# EAGLE board tester-rp (EAGLE 6.6.0), part 1 of 2
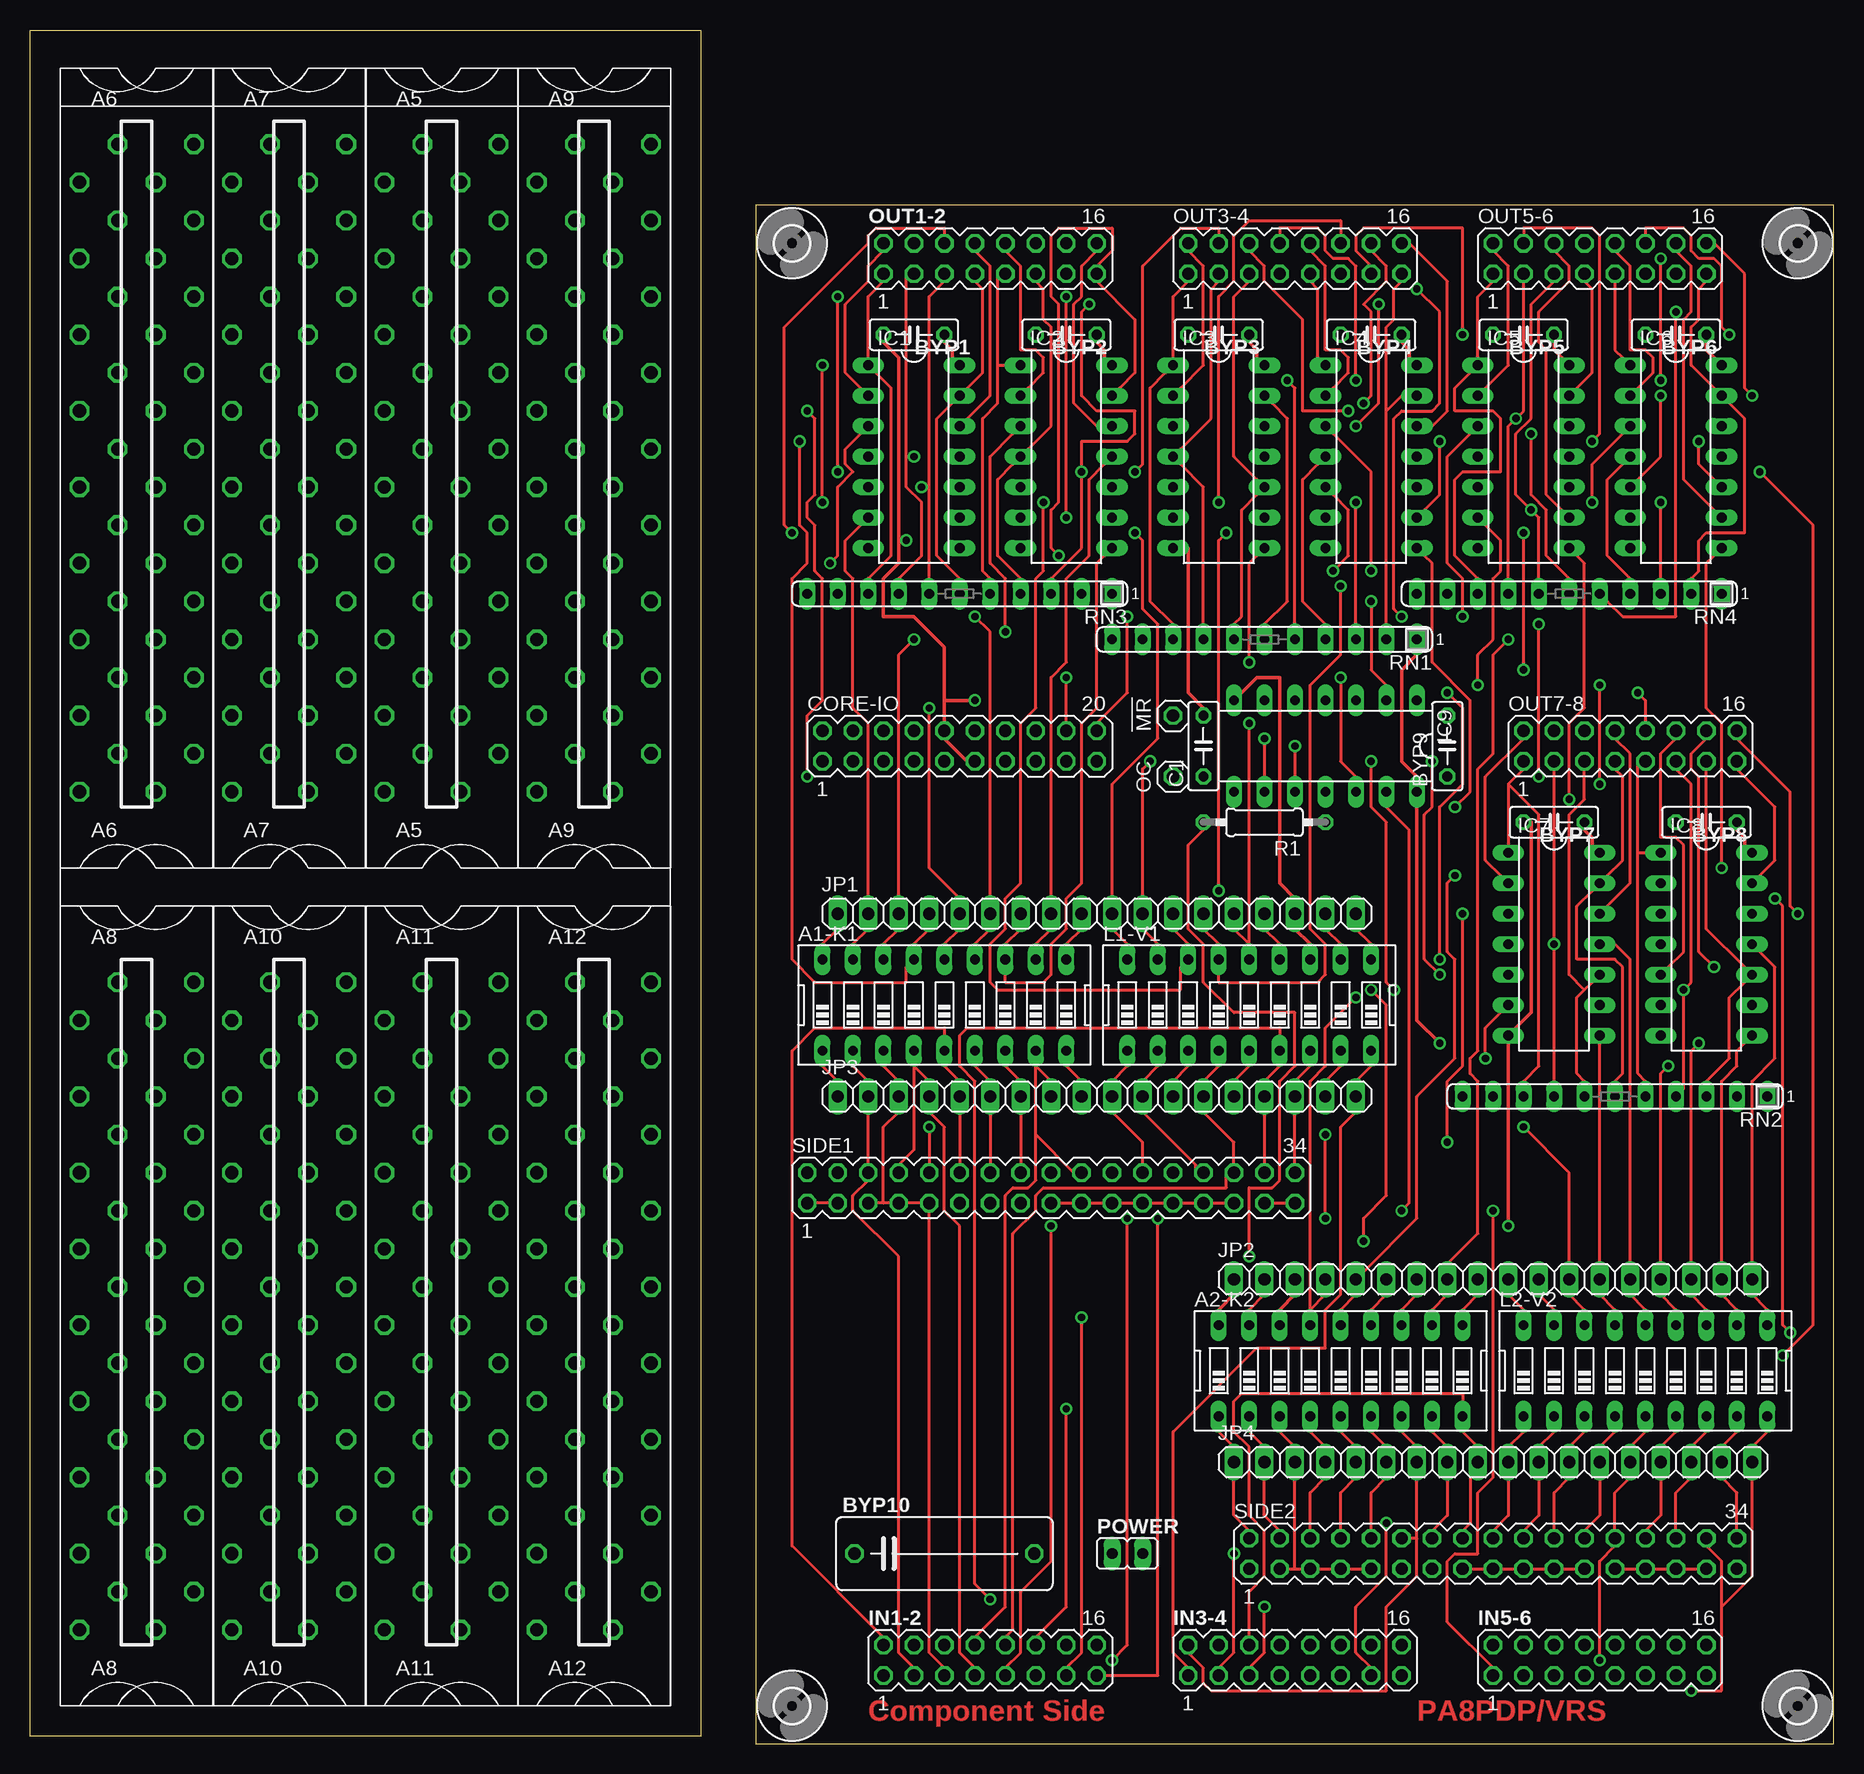
[diagram p3: board, top side]
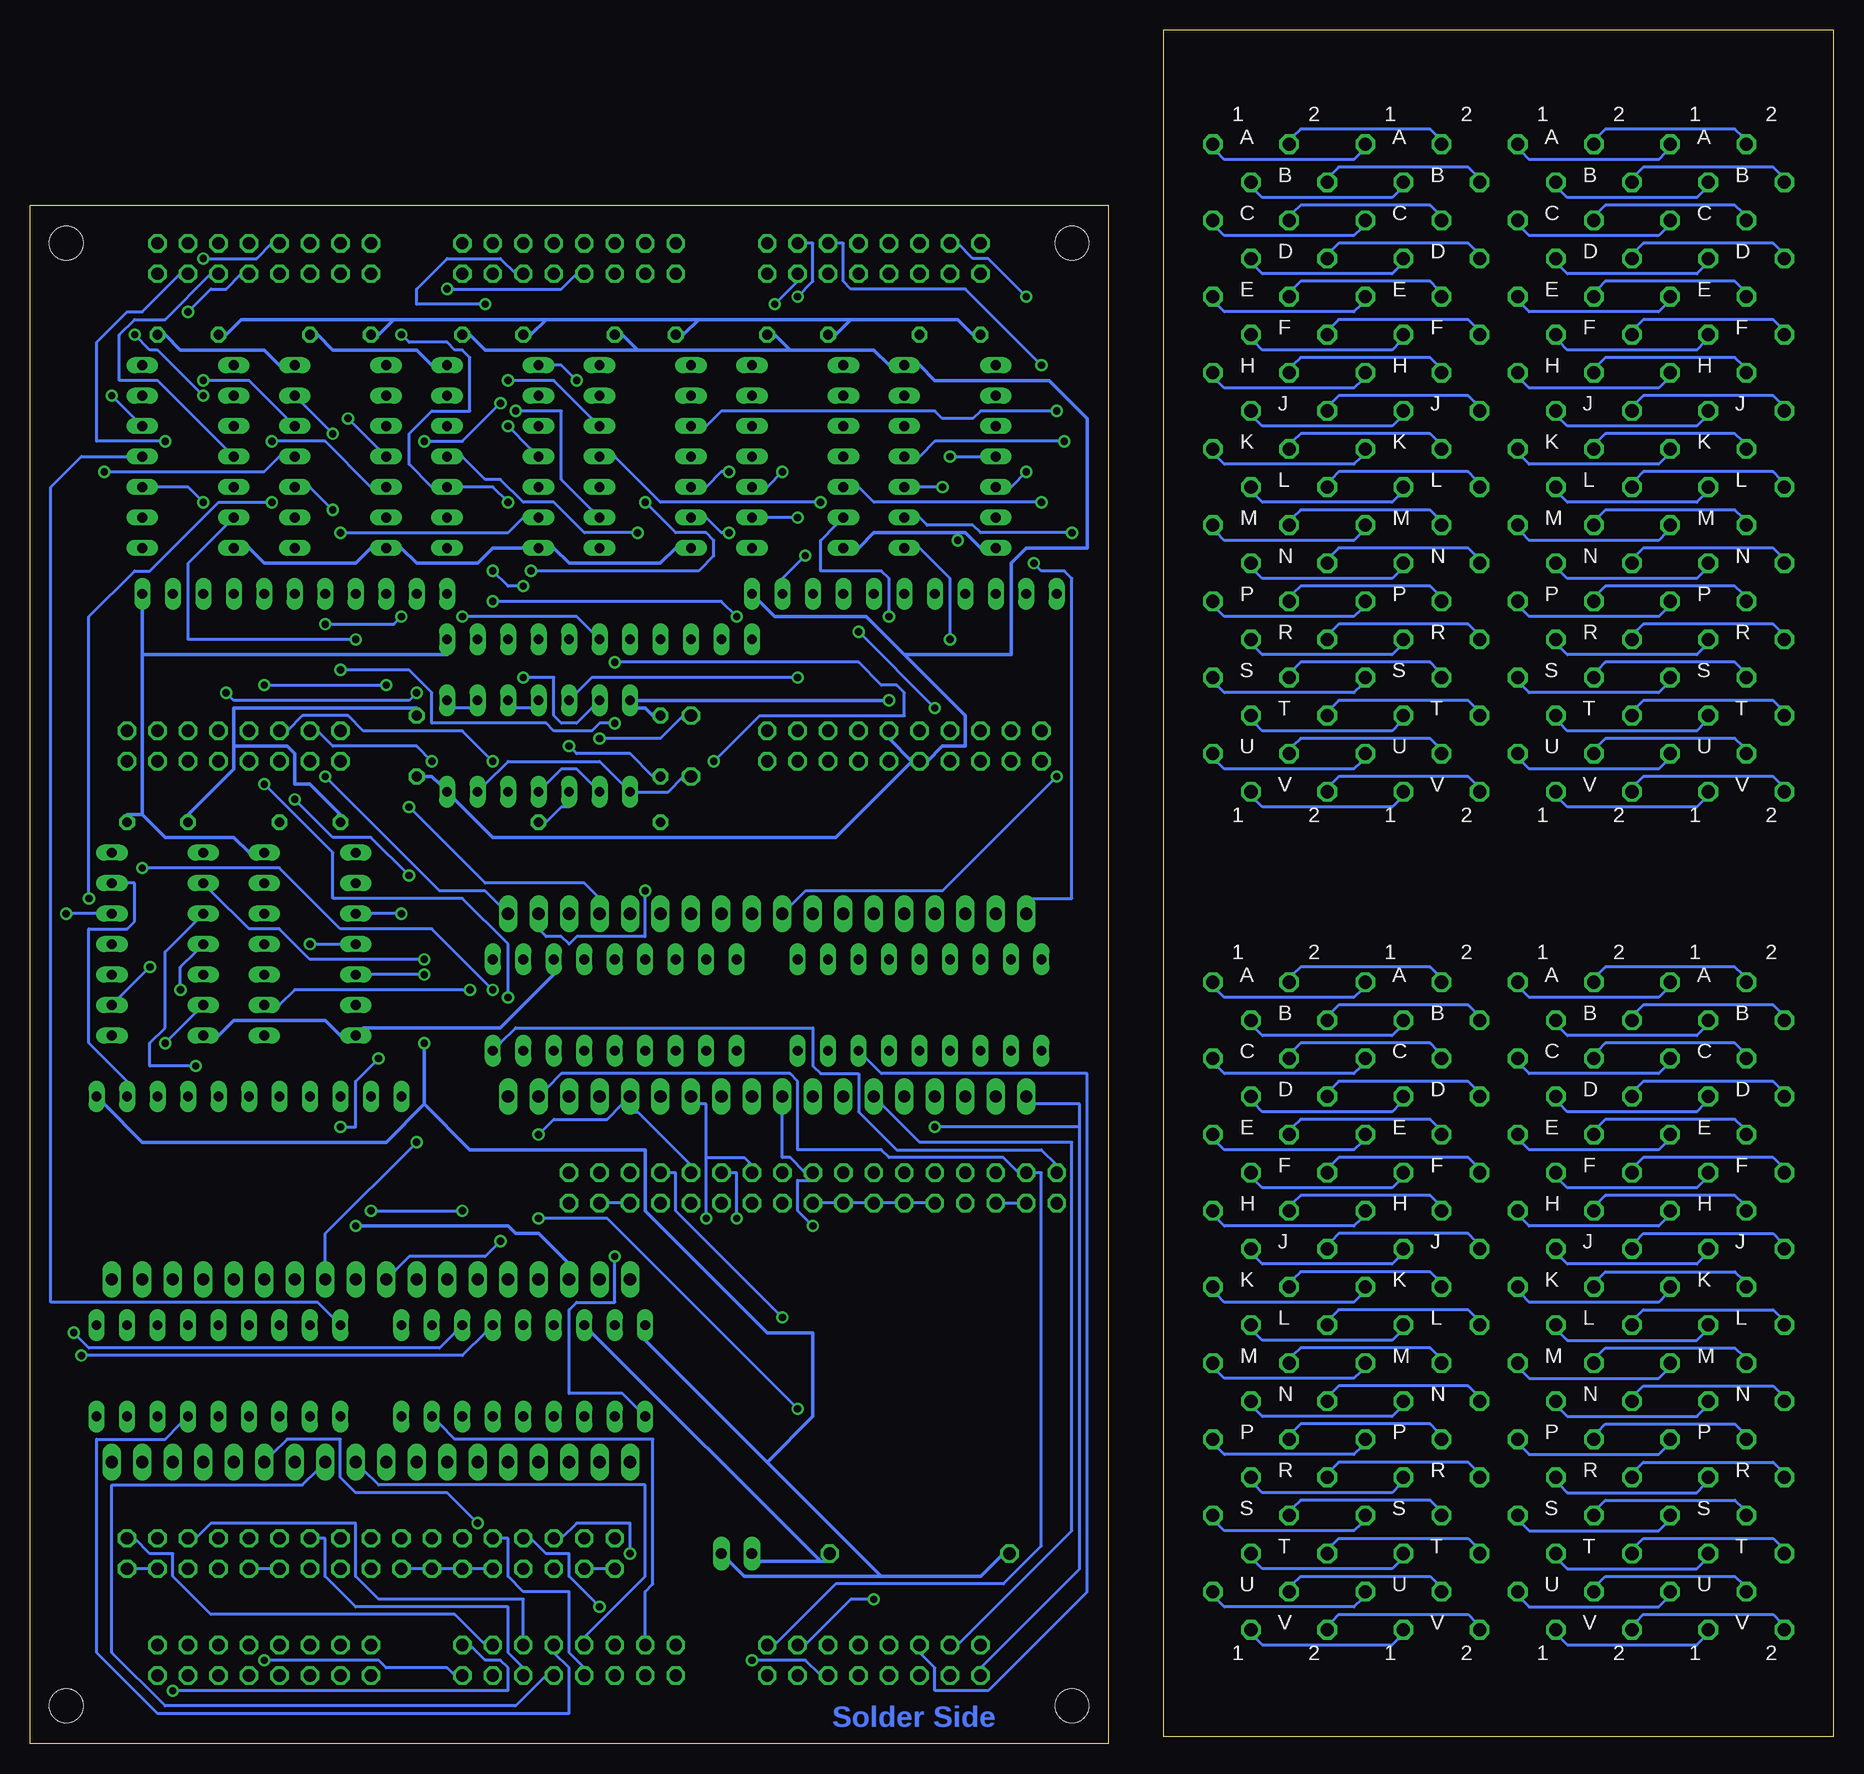
[diagram p4: board, bottom side, seen from below]

Size 150.33 x 142.86 mm. Coordinates in mm from the lower left corner, seen from the top.
Outline: 60.49,128.25 60.49,0 150.33,0 150.33,128.25 60.49,128.25
Outline: 55.88,0.62 0,0.62 0,142.86 55.88,142.86 55.88,0.62
Copper layers (1*16): Top 0.035mm / dielectric 1.5mm / Bottom 0.035mm
Design rules "olimex10mil": minimum track width 10mil, minimum drill 24mil, track to track 10mil, track to pad 10mil, pad to pad 10mil, via to via 10mil, smd to smd 10mil, copper to edge 40mil, drill to drill 10mil, minimum pad ring 10mil, minimum via ring 8mil, stop-mask expansion 0mil, vias tented up to drill 0mil, thermal gap 10mil
Net classes: 1 Power: width 0.305 mm, clearance 0.305 mm

## Footprints (pad centres in the part's own frame; a part is rotated, then mirrored left to right if it is on the bottom)
1X01 = drill 1.016 octagon: 1 0,0
EDG-09 = drill 0.813 long: 1 -10.16,-3.81; 2 -7.62,-3.81; 3 -5.08,-3.81; 4 -2.54,-3.81; 5 0,-3.81; 6 2.54,-3.81; 7 5.08,-3.81; 8 7.62,-3.81; 9 10.16,-3.81; 10 10.16,3.81; 11 7.62,3.81; 12 5.08,3.81; 13 2.54,3.81; 14 0,3.81; 15 -2.54,3.81; 16 -5.08,3.81; 17 -7.62,3.81; 18 -10.16,3.81
H807 = drill 1.092 octagon: A1 4.763,28.575; A2 -1.587,28.575; B1 1.587,25.4; B2 -4.763,25.4; C1 4.763,22.225; C2 -1.587,22.225; D1 1.587,19.05; D2 -4.763,19.05; E1 4.763,15.875; E2 -1.587,15.875; F1 1.587,12.7; F2 -4.763,12.7; H1 4.763,9.525; H2 -1.587,9.525; J1 1.587,6.35; J2 -4.763,6.35; K1 4.763,3.175; K2 -1.587,3.175; L1 1.587,0; L2 -4.763,0; M1 4.763,-3.175; M2 -1.587,-3.175; N1 1.587,-6.35; N2 -4.763,-6.35; P1 4.763,-9.525; P2 -1.587,-9.525; R1 1.587,-12.7; R2 -4.763,-12.7; S1 4.763,-15.875; S2 -1.587,-15.875; T1 1.587,-19.05; T2 -4.763,-19.05; U1 4.763,-22.225; U2 -1.587,-22.225; V1 1.587,-25.4; V2 -4.763,-25.4
C050-025X075 = drill 0.813 octagon: 1 -2.54,0; 2 2.54,0
C150-064X183 = drill 1.016 octagon: 1 -7.493,0; 2 7.493,0
MA10-2 = drill 1.016 octagon: 1 -11.43,-1.27; 2 -11.43,1.27; 3 -8.89,-1.27; 4 -8.89,1.27; 5 -6.35,-1.27; 6 -6.35,1.27; 7 -3.81,-1.27; 8 -3.81,1.27; 9 -1.27,-1.27; 10 -1.27,1.27; 11 1.27,-1.27; 12 1.27,1.27; 13 3.81,-1.27; 14 3.81,1.27; 15 6.35,-1.27; 16 6.35,1.27; 17 8.89,-1.27; 18 8.89,1.27; 19 11.43,-1.27; 20 11.43,1.27
DIL14 = drill 0.813 long: 1 -7.62,-3.81; 2 -5.08,-3.81; 3 -2.54,-3.81; 4 0,-3.81; 5 2.54,-3.81; 6 5.08,-3.81; 7 7.62,-3.81; 8 7.62,3.81; 9 5.08,3.81; 10 2.54,3.81; 11 0,3.81; 12 -2.54,3.81; 13 -5.08,3.81; 14 -7.62,3.81
MA08-2 = drill 1.016 octagon: 1 -8.89,-1.27; 2 -8.89,1.27; 3 -6.35,-1.27; 4 -6.35,1.27; 5 -3.81,-1.27; 6 -3.81,1.27; 7 -1.27,-1.27; 8 -1.27,1.27; 9 1.27,-1.27; 10 1.27,1.27; 11 3.81,-1.27; 12 3.81,1.27; 13 6.35,-1.27; 14 6.35,1.27; 15 8.89,-1.27; 16 8.89,1.27
1X18 = drill 1.016 long: 1 -21.59,0; 2 -19.05,0; 3 -16.51,0; 4 -13.97,0; 5 -11.43,0; 6 -8.89,0; 7 -6.35,0; 8 -3.81,0; 9 -1.27,0; 10 1.27,0; 11 3.81,0; 12 6.35,0; 13 8.89,0; 14 11.43,0; 15 13.97,0; 16 16.51,0; 17 19.05,0; 18 21.59,0
JP1 = drill 0.914 long: 1 0,-1.27; 2 0,1.27
0207/10 = drill 0.813 octagon: 1 -5.08,0; 2 5.08,0
SIL11 = drill 0.813 long: 1 -12.7,0; 2 -10.16,0; 3 -7.62,0; 4 -5.08,0; 5 -2.54,0; 6 0,0; 7 2.54,0; 8 5.08,0; 9 7.62,0; 10 10.16,0; 11 12.7,0
MA17-2 = drill 1.016 octagon: 1 -20.32,-1.27; 2 -20.32,1.27; 3 -17.78,-1.27; 4 -17.78,1.27; 5 -15.24,-1.27; 6 -15.24,1.27; 7 -12.7,-1.27; 8 -12.7,1.27; 9 -10.16,-1.27; 10 -10.16,1.27; 11 -7.62,-1.27; 12 -7.62,1.27; 13 -5.08,-1.27; 14 -5.08,1.27; 15 -2.54,-1.27; 16 -2.54,1.27; 17 0,-1.27; 18 0,1.27; 19 2.54,-1.27; 20 2.54,1.27; 21 5.08,-1.27; 22 5.08,1.27; 23 7.62,-1.27; 24 7.62,1.27; 25 10.16,-1.27; 26 10.16,1.27; 27 12.7,-1.27; 28 12.7,1.27; 29 15.24,-1.27; 30 15.24,1.27; 31 17.78,-1.27; 32 17.78,1.27; 33 20.32,-1.27; 34 20.32,1.27
2,8 = hole 2.8: 0,0

## Placement (x,y rotation side)
!MR  !MR  [1X01]  95.25,85.71 90 top
A1-K1  A1-K1  [EDG-09]  76.2,61.58 0 top
A2-K2  A2-K2  [EDG-09]  109.22,31.1 0 top
A5  [H807]  34.29,104.76 0 top
A6  [H807]  8.89,104.76 0 top
A7  [H807]  21.59,104.76 0 top
A8  [H807]  8.89,34.91 0 top
A9  [H807]  46.99,104.76 0 top
A10  [H807]  21.59,34.91 0 top
A11  [H807]  34.29,34.91 0 top
A12  [H807]  46.99,34.91 0 top
BYP1  0.1uf  [C050-025X075]  73.66,117.46 180 top
BYP2  0.1uf  [C050-025X075]  86.36,117.46 180 top
BYP3  0.1uf  [C050-025X075]  99.06,117.46 180 top
BYP4  0.1uf  [C050-025X075]  111.76,117.46 180 top
BYP5  0.1uf  [C050-025X075]  124.46,117.46 180 top
BYP6  0.1uf  [C050-025X075]  137.16,117.46 180 top
BYP7  0.1uf  [C050-025X075]  127,76.82 180 top
BYP8  0.1uf  [C050-025X075]  139.7,76.82 180 top
BYP9  0.1uf  [C050-025X075]  118.11,83.17 90 top
BYP10  100uf 25V  [C150-064X183]  76.2,15.86 0 top
C1  0.1uf  [C050-025X075]  97.79,83.17 90 top
CORE-IO  [MA10-2]  77.47,83.17 0 top
IC1  74LS125N  [DIL14]  73.66,107.3 270 top
IC2  74LS125N  [DIL14]  86.36,107.3 270 top
IC3  74LS125N  [DIL14]  99.06,107.3 270 top
IC4  74LS125N  [DIL14]  111.76,107.3 270 top
IC5  74LS125N  [DIL14]  124.46,107.3 270 top
IC6  74LS125N  [DIL14]  137.16,107.3 270 top
IC7  74LS125N  [DIL14]  127,66.66 270 top
IC8  74LS125N  [DIL14]  139.7,66.66 270 top
IC9  74LS00N  [DIL14]  107.95,83.17 180 top
IN1-2  [MA08-2]  80.01,6.97 0 top
IN3-4  [MA08-2]  105.41,6.97 0 top
IN5-6  [MA08-2]  130.81,6.97 0 top
JP1  [1X18]  88.9,69.2 0 top
JP2  [1X18]  121.92,38.72 0 top
JP3  [1X18]  88.9,53.96 0 top
JP4  [1X18]  121.92,23.48 0 top
L1-V1  L1-V1  [EDG-09]  101.6,61.58 0 top
L2-V2  L2-V2  [EDG-09]  134.62,31.1 0 top
OC  OC  [1X01]  95.25,80.63 90 top
OUT1-2  [MA08-2]  80.01,123.81 0 top
OUT3-4  [MA08-2]  105.41,123.81 0 top
OUT5-6  [MA08-2]  130.81,123.81 0 top
OUT7-8  [MA08-2]  133.35,83.17 0 top
POWER  POWER  [JP1]  91.44,15.86 270 top
R1  1K  [0207/10]  102.87,76.82 180 top
RN1  [SIL11]  102.87,92.06 180 top
RN2  [SIL11]  132.08,53.96 180 top
RN3  [SIL11]  77.47,95.87 180 top
RN4  [SIL11]  128.27,95.87 180 top
SIDE1  [MA17-2]  85.09,46.34 0 top
SIDE2  [MA17-2]  121.92,15.86 0 top
U$1  [2,8]  63.5,3.16 270 top
U$2  [2,8]  147.32,3.16 270 top
U$3  [2,8]  147.32,125.08 270 top
U$4  [2,8]  63.5,125.08 270 top
U$5  [CBLOCK]  2.54,3.16 0 top